# EasyEDA Pro project LeTian-robot2（轮腿机器人）.eprj, schematic Power-SCH
Page Name: P1; Project Name: LeTian-robot2; Schematic Name: Power-SCH; Update Date: 2022-11-07
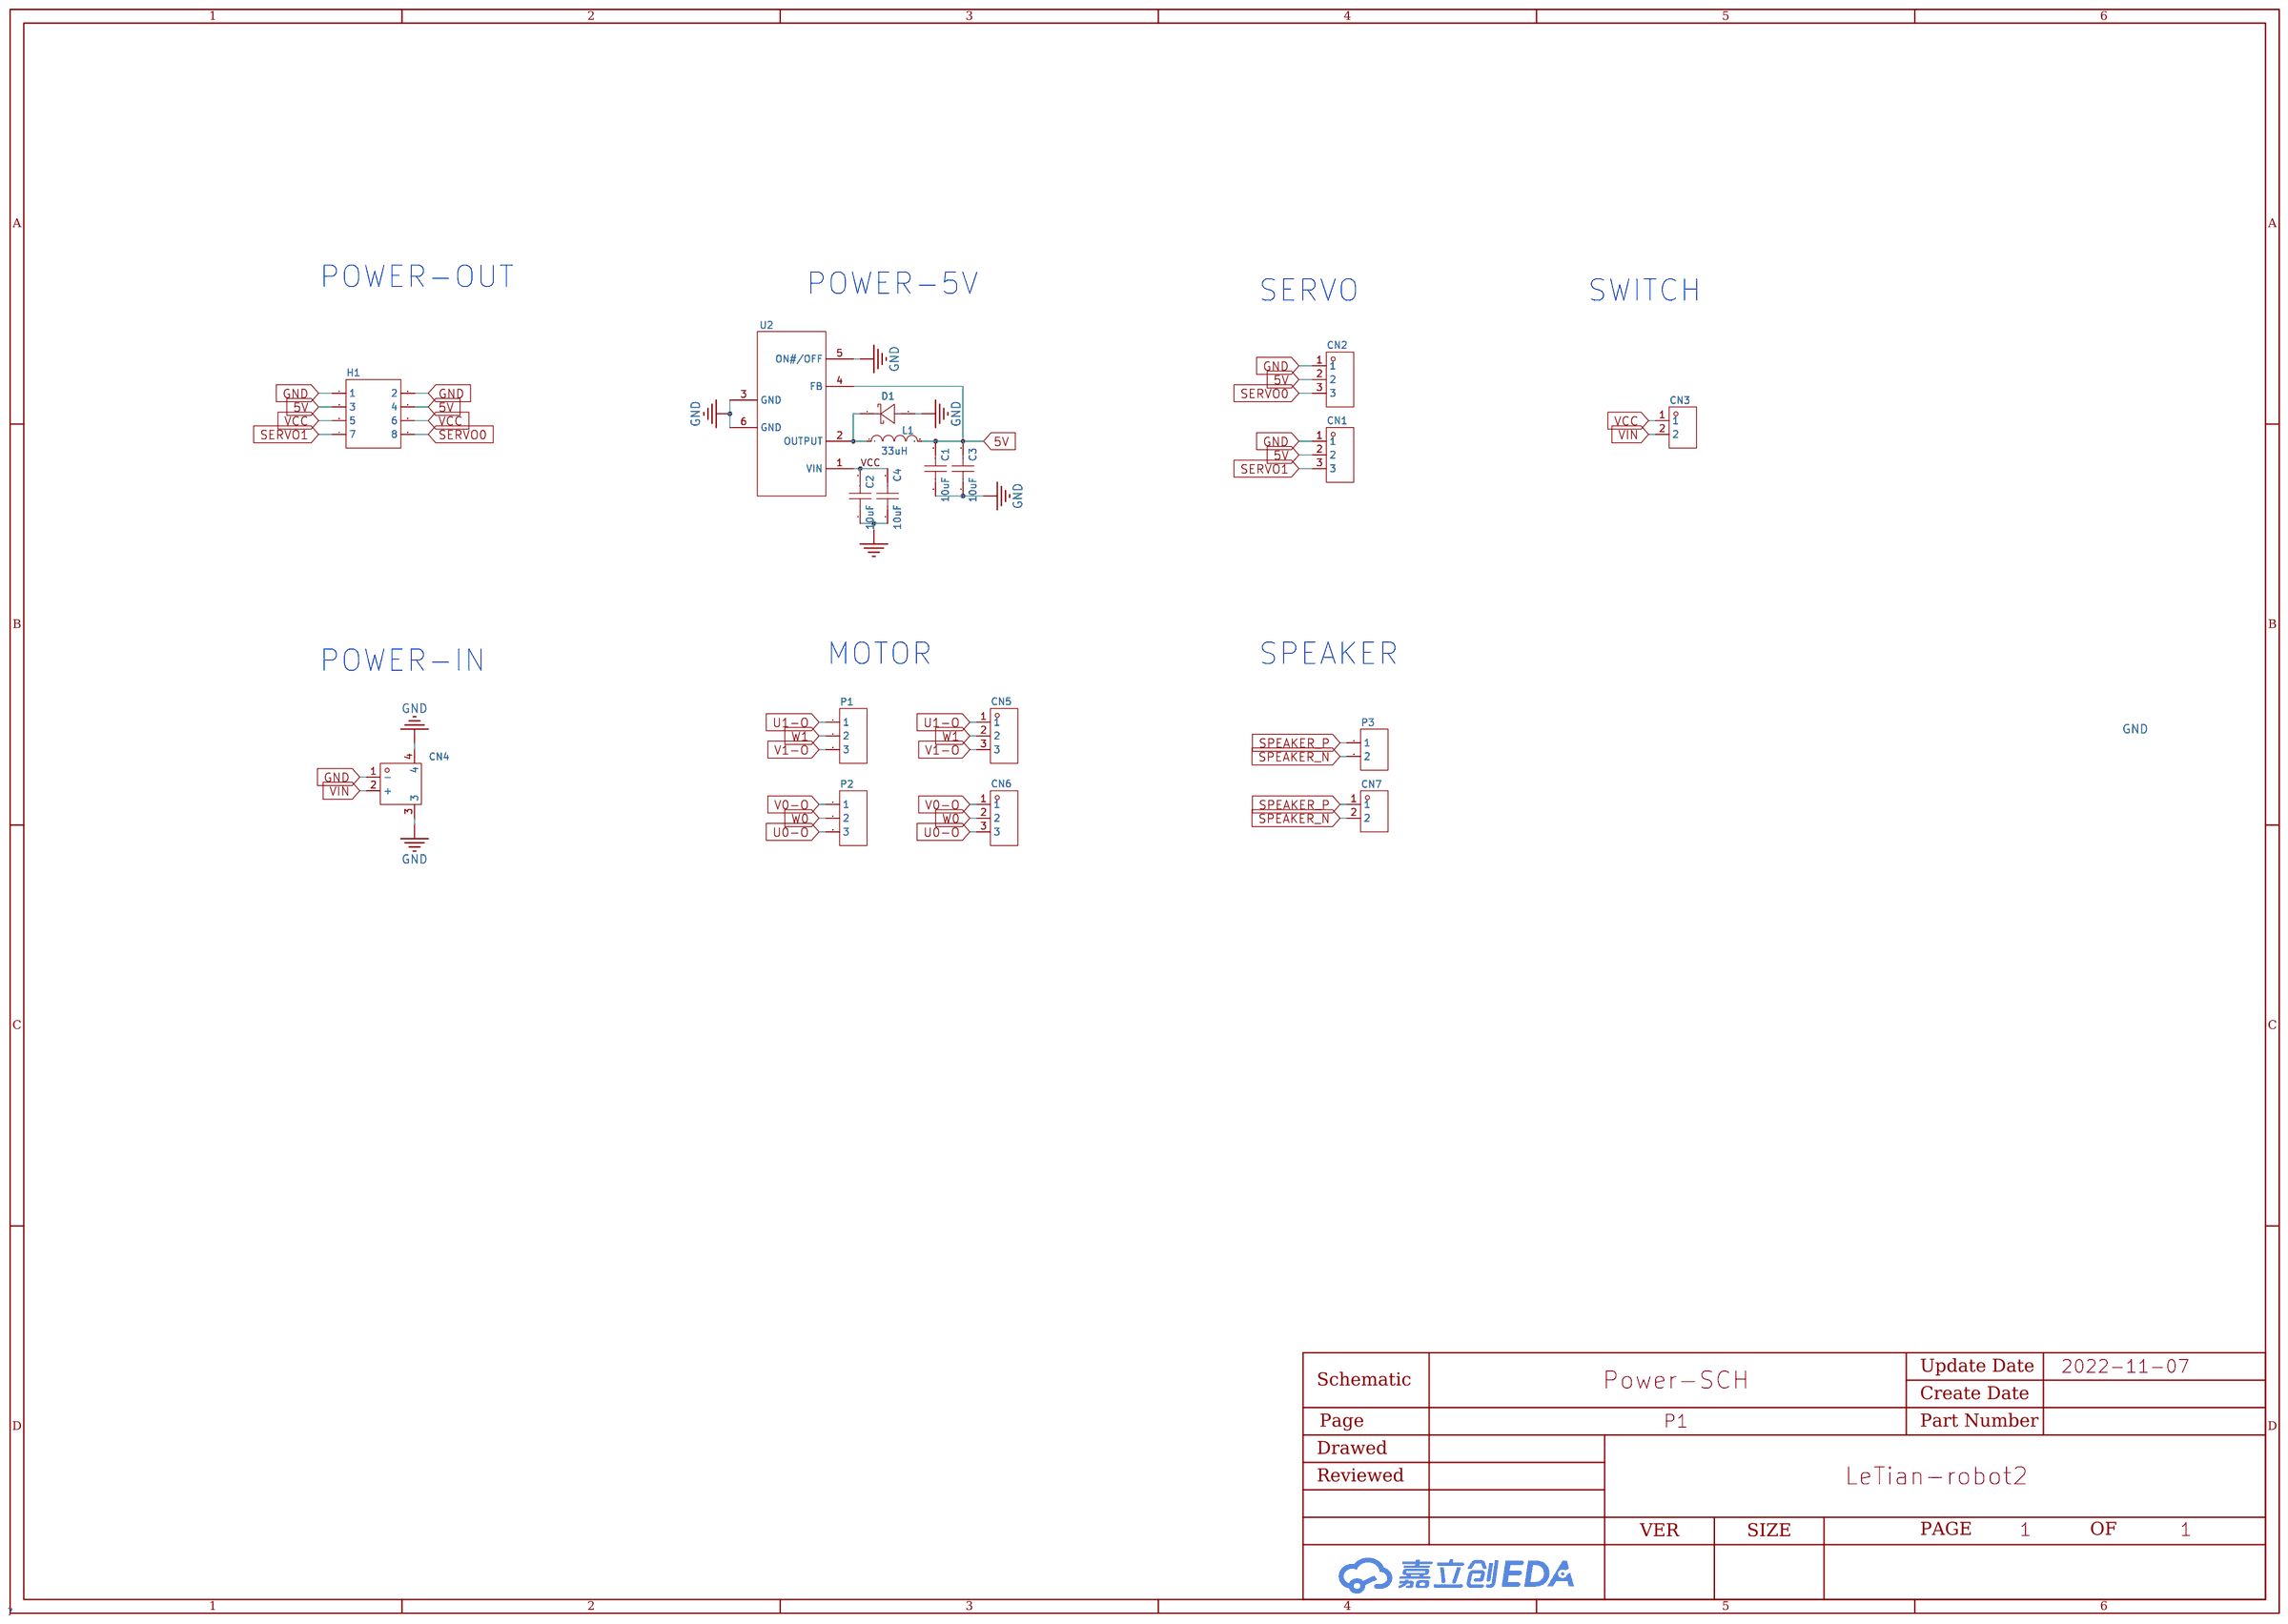
[diagram p3: schematic sheet]

## Parts
C1  10uF  [C1812]
C2  10uF  [C1812]
C3  10uF  [C1812]
C4  10uF  [C1812]
CN1  M2501R-03P  [CONN-TH_3P-P2.50_M2501R-03P]
CN2  M2501R-03P  [CONN-TH_3P-P2.50_M2501R-03P]
CN3  HX25003-2WAP  [CONN-TH_2P-P2.50_HX25003-2WAP]
CN4  XT60PW-M  [CONN-TH_XT60PW-M]
CN5  M2501R-03P  [CONN-TH_3P-P2.50_M2501R-03P]
CN6  M2501R-03P  [CONN-TH_3P-P2.50_M2501R-03P]
CN7  HX25003-2WAP  [CONN-TH_2P-P2.50_HX25003-2WAP]
D1  SS34AT  [SMA_L4.3-W2.5-LS5.0-RD]
H1  A2541HWV-2x4P  [HDR-TH_8P-P2.54-V-F-R2-C4-S2.54-1]
L1  33uH  [IND-SMD_L7.0-W6.6_FXL0630]
P1  2.54-1*3P母  [HDR-TH_3P-P2.54-V-F]
P2  2.54-1*3P母  [HDR-TH_3P-P2.54-V-F]
P3  2.54-1*2P母  [HDR-TH_2P-P2.54-V-F]
U2  LM2596SX-5.0/NOPB  [TO-263-5_L10.2-W8.9-P1.70-TL]

## Library data of the parts
C1-C4 = TCC1812Y5V106Z500GT: 容值:10uF;精度:-20%~+80%;额定电压:50V;材质(温度系数):Y5V;; LCSC Part Name: 10uF -20%~+80% 50V; Supplier Part: C377138; Manufacturer: CCTC(三环); Supplier Footprint: 1812; JLCPCB Part Class: Extended Part; Datasheet: https://atta.szlcsc.com/upload/public/pdf/source/20190410/C377138_9D1C6A9DF879937C5DC4F0E028D333DB.pdf; Supplier: LCSC; Tolerance: -20%~+80%; Voltage Rated: 50V; Temperature Coefficient: Y5V
CN1 CN2 CN5 CN6 = M2501R-03P: 参考系列:-;间距:2.5mm;插针结构:1x3P;排数:1;每排PIN数:3;行距:-;公母:公型插针;安装方式:弯插;额定电流:3A;工作温度范围:-25~+85;; LCSC Part Name: 针座 XH 3P 弯插3PIN/位; Supplier Part: C492466; Manufacturer: XFCN(台湾兴飞); Supplier Footprint: 插件,P=2.5mm; JLCPCB Part Class: Extended Part; Datasheet: https://atta.szlcsc.com/upload/public/pdf/source/20200309/C492466_0795E9C7A7160580BBEB5547CCEFA0B2.pdf; Supplier: LCSC; Pitch: 2.5mm; Pins Structure: 1x3P; Number of Rows: 1; Number of PINs Per Row: 3; Gender: 公型插针; Mounting Style: 弯插; Current Rating (Max): 3A; Operating Temperature Range: -25~+85
CN3 CN7 = HX25003-2WAP: 参考系列:XH;间距:2.5mm;插针结构:1x2P;排数:1;每排PIN数:2;行距:-;公母:公型插针;安装方式:弯插;额定电流:-;工作温度范围:-;; LCSC Part Name: 母座 弯插/弯针 2.5mm 2Pin位; Supplier Part: C442326; Manufacturer: HX(红星); Supplier Footprint: 插件,P=2.5mm; JLCPCB Part Class: Extended Part; Datasheet: https://atta.szlcsc.com/upload/public/pdf/source/20191028/C442326_951D1FF48F4BC139C99E649B2A876D28.pdf; Supplier: LCSC; Reference Series: XH; Pitch: 2.5mm; Pins Structure: 1x2P; Number of Rows: 1; Number of PINs Per Row: 2; Gender: 公型插针; Mounting Style: 弯插
CN4 = XT60PW-M: 模型锂电连接器; LCSC Part Name: XT60PW 公头 板插卧式; Supplier Part: C98732; Manufacturer: AMASS(艾迈斯); Supplier Footprint: Through Hole; JLCPCB Part Class: Extended Part; Datasheet: https://atta.szlcsc.com/upload/public/pdf/source/20180125/C98732_15168617837851301983.pdf; Supplier: LCSC
D1 = SS34AT: 二极管配置:独立式;直流反向耐压(Vr):40V;平均整流电流(Io):3A;正向压降(Vf):550mV@3A;反向电流(Ir):500A@40V;; LCSC Part Name: 40V 3A 550mV@3A; Supplier Part: C915738; Manufacturer: 艾吉芯(Agertech); Supplier Footprint: SMA; JLCPCB Part Class: Extended Part; Datasheet: https://atta.szlcsc.com/upload/public/pdf/source/20201105/C915738_E132CEDDCC4A2D6B42902CEE4D90C633.pdf; Supplier: LCSC; Diode Configuration: 独立式; Reverse Voltage (Vr): 40V; Average Rectified Current (Io): 3A; Forward Voltage (Vf@If): 550mV@3A; Reverse Leakage Current (Ir): 500A@40V
H1 = A2541HWV-2x4P: 间距:2.54mm;总孔位数:8;排数:2;插孔结构:2x4P;行距:2.54mm;安装类型:直插;塑高:-;触头材质:黄铜;触头镀层:金;; LCSC Part Name: 2.54mm 2x4P; Supplier Part: C239344; Manufacturer: CJT(长江连接器); Supplier Footprint: 直插,P=2.54mm; JLCPCB Part Class: Extended Part; Datasheet: https://atta.szlcsc.com/upload/public/pdf/source/20180724/C239344_5689AF3CE0863572E779D68311E1991C.pdf; Supplier: LCSC; Pitch: 2.54mm; Number of Holes: 8; Number of Rows: 2; Holes Structure: 2x4P; Row Spacing: 2.54mm; Mounting Type: 直插; Contact Material: 黄铜; Contact Plating: 金
L1 = FXL0630-330-M: 电感值:33uH;精度:±20%;额定电流:2A;饱和电流(Isat):2.5A;直流电阻(DCR):280mΩ;; LCSC Part Name: 33uh ±20% 2A 280mΩ; Supplier Part: C177245; Manufacturer: cjiang(长江微电); Supplier Footprint: SMD,0603; JLCPCB Part Class: Extended Part; Datasheet: https://atta.szlcsc.com/upload/public/pdf/source/20190322/C177245_B6D47EABD2B6A0A587D0BB07F0011CE2.pdf; Supplier: LCSC; Tolerance: ±20%; Rated Current: 2A; Saturation Current (Isat): 2.5A; DC Resistance (DCR): 280mΩ
P1 P2 = 2.54-1*3P母: 间距:2.54mm;总孔位数:3;排数:1;行距:-;安装类型:直插;塑高:-;触头材质:-;触头镀层:金;; LCSC Part Name: 2.54mm 环保镀金; Supplier Part: C146243; Manufacturer: BOOMELE(博穆精密); Supplier Footprint: 直插,P=2.54mm; JLCPCB Part Class: Extended Part; Datasheet: https://atta.szlcsc.comnull; Supplier: LCSC; Pitch: 2.54mm; Number of Holes: 3; Number of Rows: 1; Mounting Type: 直插; Contact Plating: 金
P3 = 2.54-1*2P母: 间距:2.54mm;总孔位数:2;排数:1;插孔结构:1x2P;行距:-;安装类型:直插;塑高:-;触头材质:-;触头镀层:-;; LCSC Part Name: 2.54mm 1x2P; Supplier Part: C49661; Manufacturer: BOOMELE(博穆精密); Supplier Footprint: 直插,P=2.54mm; JLCPCB Part Class: Extended Part; Datasheet: https://atta.szlcsc.com/upload/public/pdf/source/20151109/1457707570988.pdf; Supplier: LCSC; Pitch: 2.54mm; Number of Holes: 2; Number of Rows: 1; Holes Structure: 1x2P; Mounting Type: 直插
U2 = LM2596SX-5.0/NOPB: 可输出电流:3A;开关工作频率:150kHz;输出类型:Fixed;输出电压的路数:1;功能类型:Step-Down;输出配置:Positive;; Supplier Part: C10002; Manufacturer: TI(德州仪器); Supplier Footprint: TO-263-5; JLCPCB Part Class: Basic Part; Datasheet: https://atta.szlcsc.com/upload/public/pdf/source/20160120/1457707753830.pdf; Supplier: LCSC

## Nets
5V: C1.2 C3.2 CN1.2 CN2.2 H1.3 H1.4 L1.2 U2.4(FB)
GND: C1.1 C2.1 C3.1 C4.1 CN1.1 CN2.1 CN4.1(-) CN4.3 CN4.4 D1.2(A) H1.1 H1.2 U2.3(GND) U2.5(ON#/OFF) U2.6(GND)
V0-O: CN6.1 P2.1
V1-O: CN5.3 P1.3
VCC: C2.2 C4.2 CN3.1 H1.5 H1.6 U2.1(VIN)
VIN: CN3.2 CN4.2(+)
SERVO0: CN2.3 H1.8
SERVO1: CN1.3 H1.7
SPEAKER_N: CN7.2 P3.2
SPEAKER_P: CN7.1 P3.1
U0-O: CN6.3 P2.3
U1-O: CN5.1 P1.1
W0: CN6.2 P2.2
W1: CN5.2 P1.2
$1N1222: D1.1(K) L1.1 U2.2(OUTPUT)

## Notes on the sheet
- POWER-OUT
- POWER-5V
- SERVO
- SWITCH
- POWER-IN
- MOTOR
- SPEAKER
